# EAGLE schematic v2 (EAGLE 6.6.0)
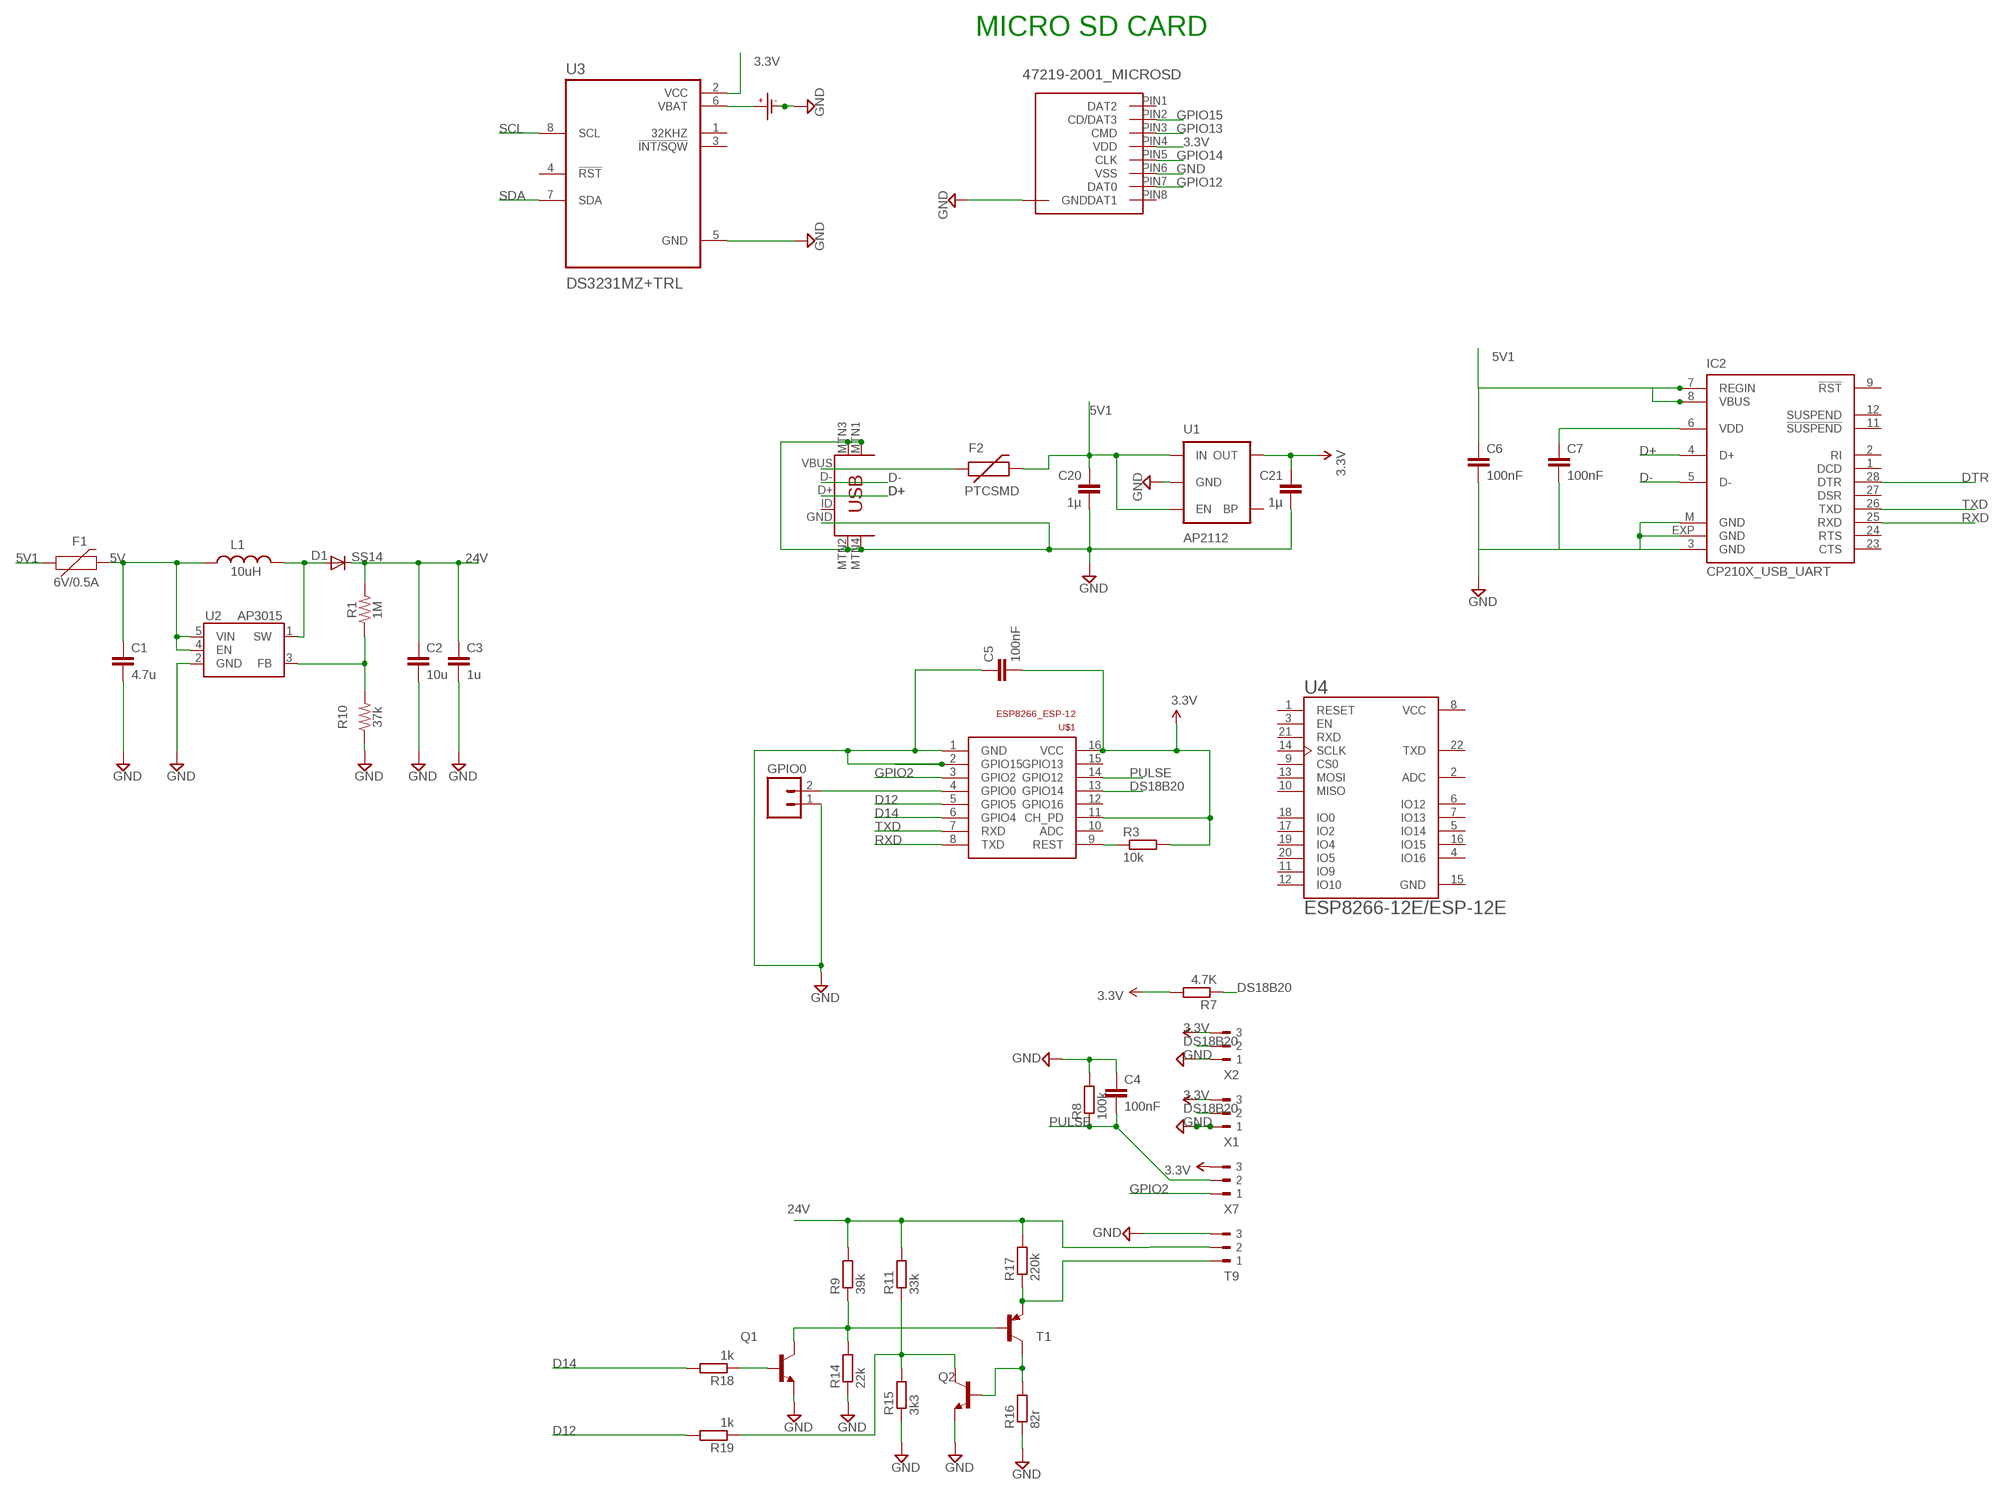
[diagram p0: schematic, sheet 1]

## Parts
C1  4.7u  1.0UF-0805-25V-(+80/-20%)  [0805]
C2  10u  1.0UF-1206-50V-10%  [1206]
C3  1u  1.0UF-1206-50V-10%  [1206]
C4  100nF  C-EUC0603  [C0603]
C5  100nF  C-EUC0603  [C0603]
C6  100nF  CAP0603-CAP  [0603-CAP]
C7  100nF  CAP0603-CAP  [0603-CAP]
C20  1µ  C-EUC0603  [C0603]
C21  1µ  C-EUC0603  [C0603]
CR1  CR1220SMD  [CR1220SMD]
D1  SS14  DIODESOD-123  [SOD-123]
F1  6V/0.5A  PPTC_HALF-AMP  [1206]
F2  PTCSMD  [PTC-1206]
GPIO0  M02PTH  [1X02]
IC2  CP210X_USB_UART  [MLP28]
L1  10uH  INDUCTORCR54  [CR54]
MICRO_SD  47219-2001_MICROSD  [47219-2001_MICROSD]
Q1  BC808-NPN-SOT23-BEC  [SOT23-BEC]
Q2  BC808-NPN-SOT23-BEC  [SOT23-BEC]
R1  1M  RESISTOR0805  [0805]
R3  10k  R-EU_R0603  [R0603]
R7  4.7K  R-EU_R0603  [R0603]
R8  100k  R-EU_R0603  [R0603]
R9  39k  R-EU_R0603  [R0603]
R10  37k  RESISTOR0805  [0805]
R11  33k  R-EU_R0603  [R0603]
R14  22k  R-EU_R0603  [R0603]
R15  3k3  R-EU_R0603  [R0603]
R16  82r  R-EU_R0603  [R0603]
R17  220k  R-EU_R0603  [R0603]
R18  1k  R-EU_R0603  [R0603]
R19  1k  R-EU_R0603  [R0603]
T1  BC807-16-PNP-SOT23-BEC  [SOT23-BEC]
T9  180-3  [180-3]
U1  AP2112  V_REG_LDOSMD  [SOT23-5]
U2  AP3015  [SOT-23-5]
U3  DS3231MZ+TRL  [SOIC127P600X175-8N]
U4  ESP8266-12E/ESP-12E  [XCVR_ESP8266-12E/ESP-12E]
U$1  ESP8266_ESP-12  [ESP8266-ESP12]
U$10  USB-MINIB-5PIN  [USB-MINIB-CISECO]
X1  180-3  [180-3]
X2  180-3  [180-3]
X7  180-3  [180-3]

## Nets
3.3V: C5.2 C21.1 MICRO_SD.PIN4(VDD) R3.2 R7.2 U1.5(OUT) U3.2(VCC) U$1.11(CH_PD) U$1.16(VCC) X1.3 X2.3 X7.3
5V: C1.1 F1.2 L1.P$1 U2.4(EN) U2.5(VIN)
5V1 [power]: C6.1 C20.1 F1.1 F2.2 IC2.7(REGIN) IC2.8(VBUS) U1.1(IN) U1.3(EN)
24V: C2.1 C3.1 D1.C R1.2 R9.2 R11.2 R17.2 T9.2
D12: R19.2 U$1.5(GPIO5)
D14: R18.2 U$1.6(GPIO4)
D+: IC2.4(D+) U$10.D+
D-: IC2.5(D-) U$10.D-
DS18B20: R7.1 U$1.13(GPIO14) X1.2 X2.2
DTR: IC2.28(DTR)
GND [power]: C1.2 C2.2 C3.2 C4.1 C5.1 C6.2 C7.2 C20.2 C21.2 CR1.P-(P$-) GPIO0.1 IC2.3(GND) IC2.EXP(GND) IC2.M(GND) MICRO_SD.P$1(GND) MICRO_SD.P$2(GND) MICRO_SD.P$3(GND) MICRO_SD.P$4(GND) MICRO_SD.PIN6(VSS) Q1.E Q2.E R8.2 R10.1 R14.1 R15.1 R16.1 T9.3 U1.2(GND) U2.2(GND) U3.5(GND) U$1.1(GND) U$1.2(GPIO15) U$10.GND U$10.MTN1(MTN2) U$10.MTN2(MTN3) U$10.MTN3(MTN1) U$10.MTN4 X1.1 X2.1
GPIO2: U$1.3(GPIO2) X7.1
GPIO12: MICRO_SD.PIN7(DAT0)
GPIO13: MICRO_SD.PIN3(CMD)
GPIO14: MICRO_SD.PIN5(CLK)
GPIO15: MICRO_SD.PIN2(CD/DAT3)
N$1: C7.1 IC2.6(VDD)
N$2: F2.1 U$10.VBUS
N$4: R1.1 R10.2 U2.3(FB)
N$5: D1.A L1.P$2 U2.1(SW)
N$6: CR1.P+(P$+) U3.6(VBAT)
N$13: R17.1 T1.E T9.1
N$16: Q2.B R16.2 T1.C
N$18: Q1.C R9.1 R14.2 T1.B
N$21: Q2.C R11.1 R15.2 R19.1
N$25: Q1.B R18.1
N$29: GPIO0.2 U$1.4(GPIO0)
N$40: R3.1 U$1.9(REST)
PULSE: C4.2 R8.1 U$1.14(GPIO12) X7.2
RXD: IC2.25(RXD) U$1.8(TXD)
SCL: U3.8(SCL)
SDA: U3.7(SDA)
TXD: IC2.26(TXD) U$1.7(RXD)
Unconnected: IC2.1(DCD) IC2.2(RI) IC2.9(!RST) IC2.11(!SUSPEND) IC2.12(SUSPEND) IC2.23(CTS) IC2.24(RTS) IC2.27(DSR) MICRO_SD.PIN1(DAT2) MICRO_SD.PIN8(DAT1) U1.4(BP) U3.1(32KHZ) U3.3(!INT/SQW) U3.4(!RST) U4.1(RESET) U4.2(ADC) U4.3(EN) U4.4(IO16) U4.5(IO14) U4.6(IO12) U4.7(IO13) U4.9(CS0) U4.10(MISO) U4.11(IO9) U4.12(IO10) U4.13(MOSI) U4.14(SCLK) U4.16(IO15) U4.17(IO2) U4.18(IO0) U4.19(IO4) U4.20(IO5) U4.21(RXD) U4.22(TXD) U$1.10(ADC) U$1.12(GPIO16) U$1.15(GPIO13) U$10.ID

## Notes on the sheet
- MICRO SD CARD

## Power pins joined to a net without a drawn wire
GND: U4.15(GND)
VCC: U4.8(VCC)

## Library data of the parts
C1 = SparkFun-Capacitors:1.0UF: 1µF ceramic capacitors A capacitor is a passive two-terminal electrical component used to store electrical energy temporarily in an electric field.; PROD_ID: CAP-11625; VALUE: 1.0uF
C2 C3 = SparkFun-Capacitors:1.0UF: 1µF ceramic capacitors A capacitor is a passive two-terminal electrical component used to store electrical energy temporarily in an electric field.; PROD_ID: CAP-09822; VALUE: 1.0uF
C4 C5 C20 C21 = resistor:C-EU: CAPACITOR, European symbol
C6 C7 = SparkFun:CAP: Capacitor Standard 0603 ceramic capacitor, and 0.1" leaded capacitor.
CR1 = IotaWatt_parts:CR1220SMD: CR1220 Battery SMD; MPN: Harwin S8411-45R
D1 = adafruit:DIODE: Diode SMADIODE - SMA Surface Mount Package 20V 1A Schottky Diode Digikey: 641-1014-6-ND DO-1N4148 - Through Hole Small Current Diode SOD-123 20V 1 A (.5mV Vf) Schottky Diode - Digikey: MBRX120TPMSCT-ND SOD-323 10V 570mA (.38mV Vf, 3ns) Schottky Diode - Digikey: ZLLS410CT-ND SOD-523 30V 30mA Schottky Diode (RB751S-40TE61) - Digikey: RB751S-40TE61CT-ND SOT23-R/W - SOT23 Package (R = Solder Paste/Reflow Ovens, W = Hand-Soldering) BAT54Film 40V 300mA - Digikey: 497-7162-1-ND
F1 = SparkFun-Fuses:PPTC: Resettable Fuse PPTC Resettable Fuse. Really a sort of resistor with a polymeric positive temperature coefficient whose resistance increases dramatically with an increase in temperature. When heated by the power passing through the resistance rises causing the current to be limited, protecting the circuit. This is achieved by the transition of the polymer from a crystalline to an amorphous state where the conductive carbon separates breaking the conductive pathways found in the cool crystalline structure. When a PPTC cools back down it resumes conducting letting the circuit turn back on. SparkFun Products: SparkFun RedBoard - Programmed with Arduino <https://www.sparkfun.com/products/12757> Pro Micro - 5V/16MHz <https://www.sparkfun.com/products/12640> Arduino Pro 328 - 5V/16MHz <https://www.sparkfun.com/products/10915> MP3 Trigger <https://www.sparkfun.com/products/13720>; PROD_ID: RES-08585
F2 = SparkFun:PTC: Resettable Fuse PTC Resettable Fuse. Spark Fun Electronics SKU : COM-08357
GPIO0 = SparkFun:M02: Header 2 Standard 2-pin 0.1" header. Use with straight break away headers (SKU : PRT-00116), right angle break away headers (PRT-00553), swiss pins (PRT-00743), machine pins (PRT-00117), and female headers (PRT-00115). Molex polarized connector foot print use with SKU : PRT-08233 with associated crimp pins and housings.
IC2 = SparkFun-DigitalIC:CP210X_USB_UART: Single-Chip USB to UART Bridge Source: www.silabs.com .. CP2101.pdf / cp2102.pdf. Spark Fun Electronics SKU : COM-00310
L1 = SparkFun:INDUCTOR: Inductors Basic Inductor/Choke - 0603 and 1206. Footprints are not proven and vary greatly between part numbers.
MICRO_SD = MOLEX 47219-2001:47219-2001_MICROSD
Q1 Q2 = transistor:*-NPN-: NPN Transistror BF959 corrected 2008.03.06
R1 R10 = SparkFun-Resistors:RESISTOR: Generic Resistor Package
R3 R7-R9 R11 R14-R19 = rcl:R-EU_: RESISTOR, European symbol
T1 = transistor:*-PNP-: PNP Transistror
T9 X1 X2 X7 = con-weidmueller-sl35:180-3: WEIDMUELLER CLAMP CONNECTOR; OC_FARNELL: unknown; OC_NEWARK: unknown
U1 = SparkFun:V_REG_LDO: Voltage Regulator LDO Standard 150mA LDO voltage regulator in SOT-23 layout. Micrel part MIC5205. BP (by-pass) pin is used to lower output noise with 470pF cap.
U2 = dword1511-pmic-dcdc:AP3015: Micro-power Step-up DC-DC Converter
U3 = DS3231MZ_TRL:DS3231MZ+TRL: Check prices <https://pricing.snapeda.com/parts/DS3231MZ%2BTRL/Maxim%20Integrated/view-part?ref=eda>; AVAILABILITY: Warning; DESCRIPTION: Real Time Clock (RTC) IC Clock/Calendar I²C, 2-Wire Serial 8-SOIC (0.154, 3.90mm Width); MF: Maxim Integrated; MP: DS3231MZ+TRL; PACKAGE: SOIC-8 Maxim; PRICE: None; PURCHASE-URL: https://pricing.snapeda.com/search/part/DS3231MZ+TRL/?ref=eda
U4 = ESP8266-12E_ESP-12E:ESP8266-12E/ESP-12E: ESP-12E WiFi Module; AVAILABILITY: Unavailable; DESCRIPTION: This WiFi module has a 32-bit MCU micro and clock speeds supporting 80 MHz or 160 MHz. Supports the RTOS and integrated Wi-Fi MAC/BB/RF/PA/LNA, and has an on-board antenna.; MF: AI-Thinker; MP: ESP8266-12E/ESP-12E; PACKAGE: None; PRICE: None
U$1 = ESP8266-ESP12:ESP8266_ESP-12
U$10 = Ciseco USB miniB_Updated:USB-MINIB: Mini-USB "B" connector with 5th pin broken out. Created new symbol breaking out 5th "ID" pin in mini/micro USB connector spec. See: http://en.wikipedia.org/wiki/Mini_usb#Cables. Uses same footprint as 4-pin symbol. Also added pins to connect to mounting / shield pads if required (probably not generally needed as signals aren't shielded once they leave the connector). Modified by Ciseco for Rapid Part 24-0357

## Net classes
0 default: width 0.203 mm, drill 0.6 mm, clearance 0.203 mm
1 power: width 0.381 mm, drill 0.6 mm, clearance 0.254 mm
2 gnd: width 0.254 mm, drill 0.6 mm, clearance 0.254 mm
3 thin_power2: width 0.254 mm, clearance 0.254 mm